# Altium schematic sheet 5_Keyboard.SchDoc
size A4
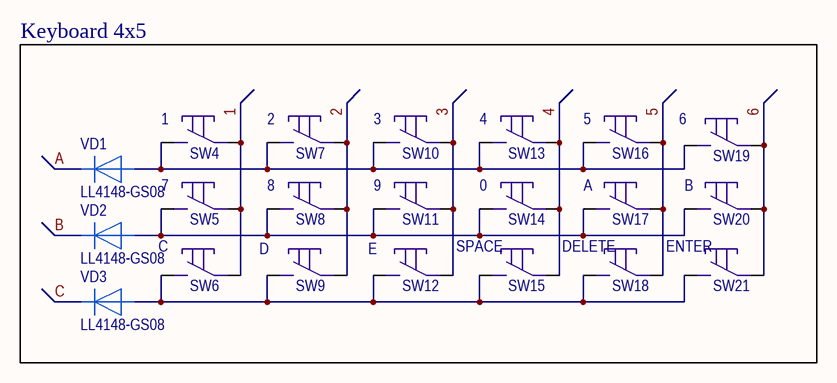
[diagram p0: 5_Keyboard.SchDoc]

## Parts
SW4  KLS7-TS6604  [KLS7-TS6604-5.0-180-B]  (value not drawn)
SW5  KLS7-TS6604  [KLS7-TS6604-5.0-180-B]  (value not drawn)
SW6  KLS7-TS6604  [KLS7-TS6604-5.0-180-B]  (value not drawn)
SW7  KLS7-TS6604  [KLS7-TS6604-5.0-180-B]  (value not drawn)
SW8  KLS7-TS6604  [KLS7-TS6604-5.0-180-B]  (value not drawn)
SW9  KLS7-TS6604  [KLS7-TS6604-5.0-180-B]  (value not drawn)
SW10  KLS7-TS6604  [KLS7-TS6604-5.0-180-B]  (value not drawn)
SW11  KLS7-TS6604  [KLS7-TS6604-5.0-180-B]  (value not drawn)
SW12  KLS7-TS6604  [KLS7-TS6604-5.0-180-B]  (value not drawn)
SW13  KLS7-TS6604  [KLS7-TS6604-5.0-180-B]  (value not drawn)
SW14  KLS7-TS6604  [KLS7-TS6604-5.0-180-B]  (value not drawn)
SW15  KLS7-TS6604  [KLS7-TS6604-5.0-180-B]  (value not drawn)
SW16  KLS7-TS6604  [KLS7-TS6604-5.0-180-B]  (value not drawn)
SW17  KLS7-TS6604  [KLS7-TS6604-5.0-180-B]  (value not drawn)
SW18  KLS7-TS6604  [KLS7-TS6604-5.0-180-B]  (value not drawn)
SW19  KLS7-TS6604  [KLS7-TS6604-5.0-180-B]  (value not drawn)
SW20  KLS7-TS6604  [KLS7-TS6604-5.0-180-B]  (value not drawn)
SW21  KLS7-TS6604  [KLS7-TS6604-5.0-180-B]  (value not drawn)
VD1  LL4148-GS08  [SOD-80]
VD2  LL4148-GS08  [SOD-80]
VD3  LL4148-GS08  [SOD-80]

## Nets
1: SW4.2 SW5.2 SW6.2
2: SW7.2 SW8.2 SW9.2
3: SW10.2 SW11.2 SW12.2
4: SW13.2 SW14.2 SW15.2
5: SW16.2 SW17.2 SW18.2
6: SW19.2 SW20.2 SW21.2
A: VD1.2
B: VD2.2
C: VD3.2
NetSW4_1: SW4.1 SW7.1 SW10.1 SW13.1 SW16.1 SW19.1 VD1.1
NetSW5_1: SW5.1 SW8.1 SW11.1 SW14.1 SW17.1 SW20.1 VD2.1
NetSW6_1: SW6.1 SW9.1 SW12.1 SW15.1 SW18.1 SW21.1 VD3.1

## Notes on the sheet
- Keyboard 4x5
- (near SW4) 1
- (near SW7) 2
- (near SW10) 3
- (near SW13) 4
- (near SW16) 5
- 6
- (near SW5) 7
- (near SW8) 8
- (near SW11) 9
- (near SW14) 0
- (near SW17) A
- (near SW20) B
- C
- D
- (near SW12) E
- SPACE
- DELETE
- ENTER

## Library data of the parts
VD1-VD3 = LL4148-GS08: Диод